# EAGLE schematic lacoolBoard_V1.1.3 (EAGLE 7.7.0)
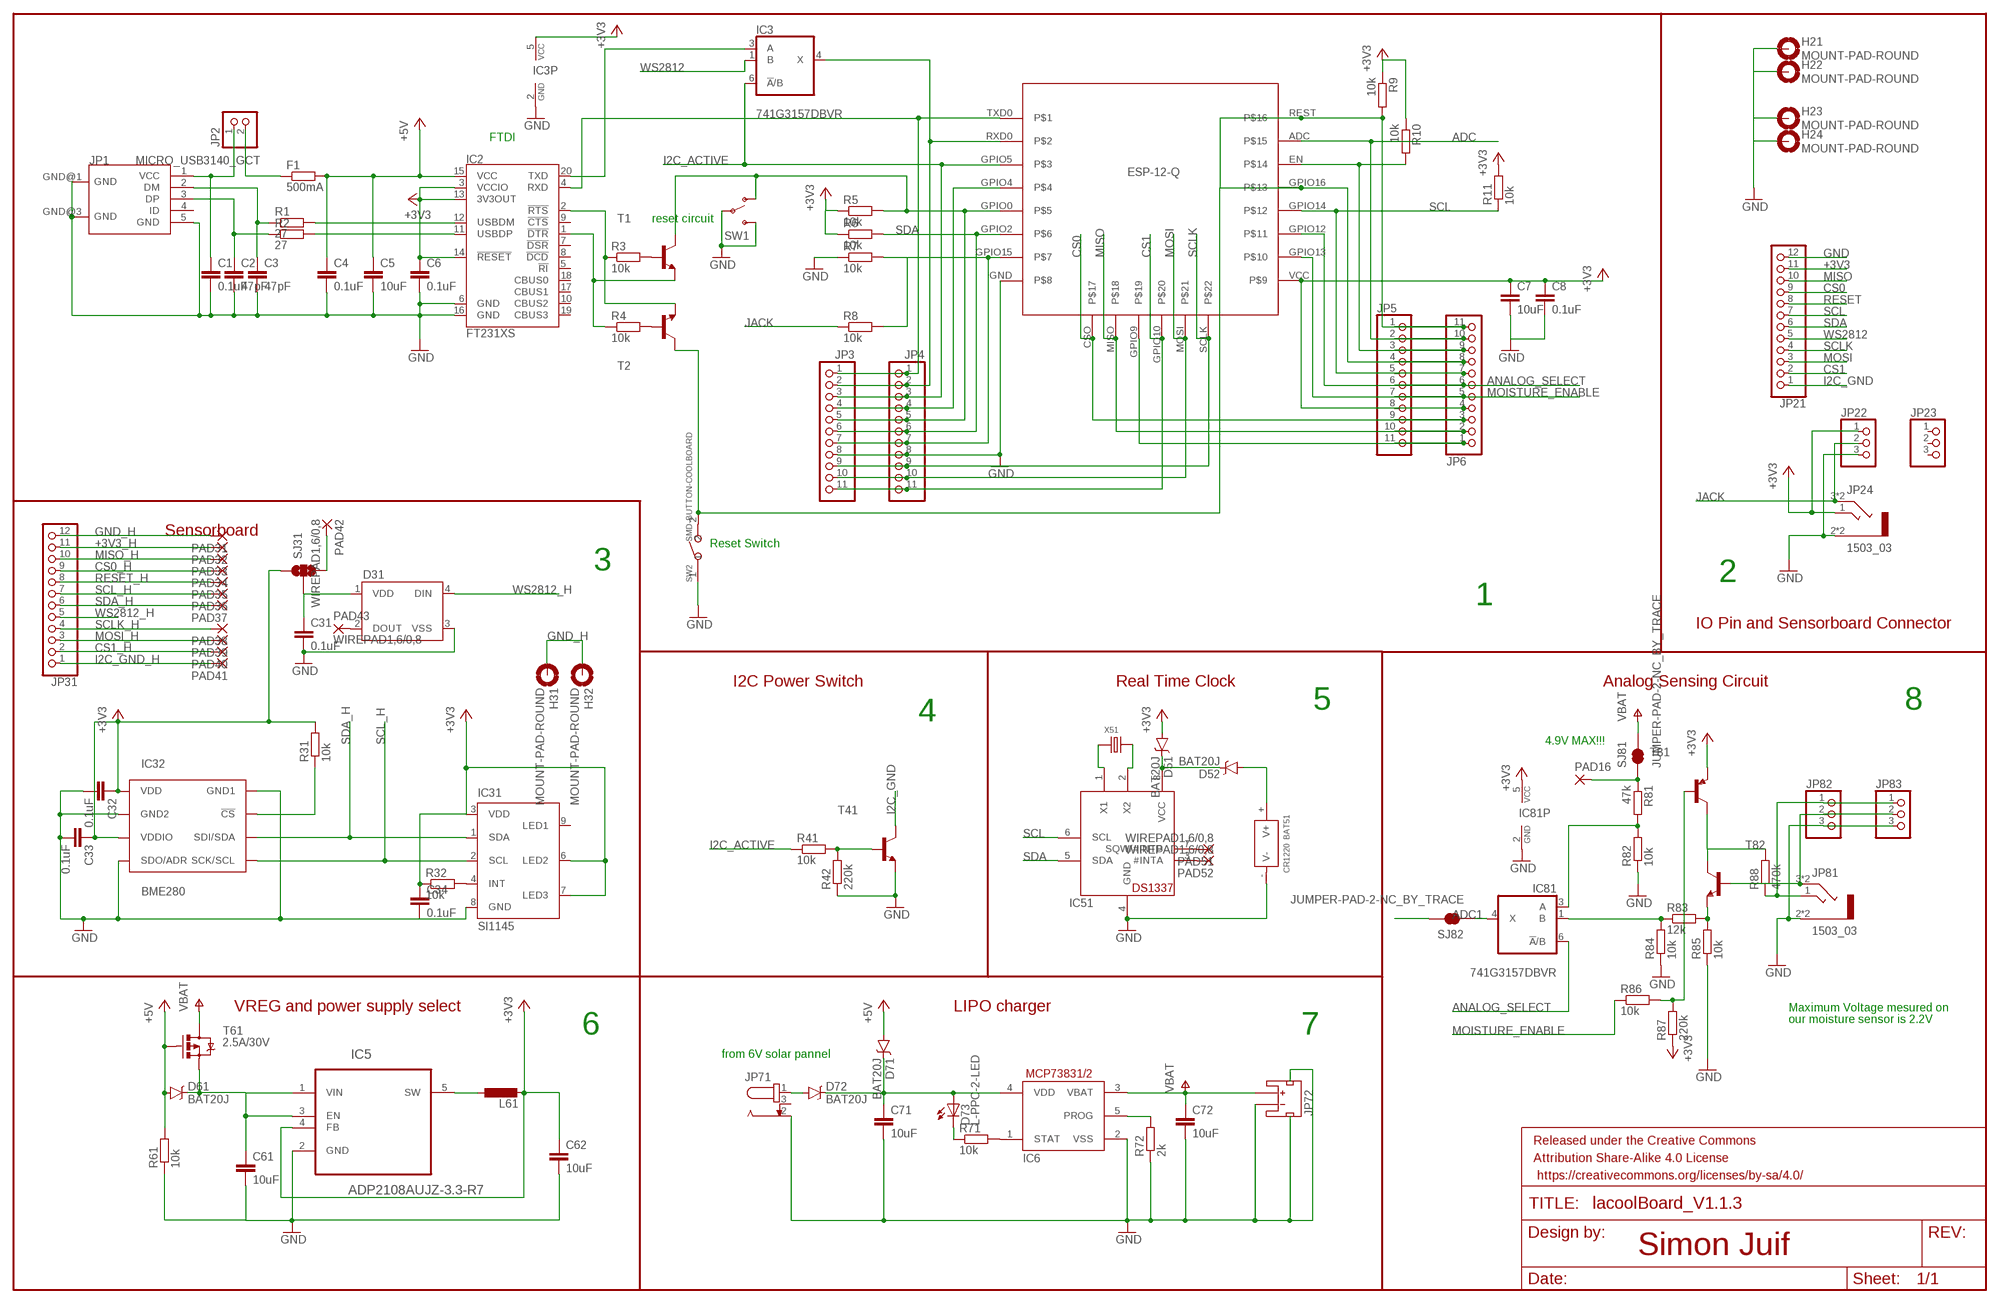
[diagram p0: schematic, sheet 1]

## Parts
BAT51  CR1220  SMD-BATTERY-CELL-HOLDER-PLASTIC  [BAT2P-SMD-16.4-CR1220]
C1  0.1uF  C-EUC0603K  [C0603K]
C2  47pF  C-EUC0603K  [C0603K]
C3  47pF  C-EUC0603K  [C0603K]
C4  0.1uF  C-EUC0603K  [C0603K]
C5  10uF  C-EUC0603K  [C0603K]
C6  0.1uF  C-EUC0603K  [C0603K]
C7  10uF  C-EUC0603K  [C0603K]
C8  0.1uF  C-EUC0603K  [C0603K]
C31  0.1uF  C-EUC0603K  [C0603K]
C32  0.1uF  C-EUC0603K  [C0603K]
C33  0.1uF  C-EUC0603K  [C0603K]
C34  0.1uF  C-EUC0603K  [C0603K]
C61  10uF  C-EUC0603K  [C0603K]
C62  10uF  C-EUC0603K  [C0603K]
C71  10uF  C-EUC0603K  [C0603K]
C72  10uF  C-EUC0603K  [C0603K]
D31  WS2812B  [WS2812B]
D51  BAT20J  DIODE-SCHOTTKY-BAT20J  [SOD-323]
D52  BAT20J  DIODE-SCHOTTKY-BAT20J  [SOD-323]
D61  BAT20J  DIODE-SCHOTTKY-BAT20J  [SOD-323]
D71  BAT20J  DIODE-SCHOTTKY-BAT20J  [SOD-323]
D72  BAT20J  DIODE-SCHOTTKY-BAT20J  [SOD-323]
D73  L-PPC-2-LED  [P-LCC-2]
F1  500mA  R-EU_M0805  [M0805]
FRAME1  FRAME-LEDGER  [CREATIVE_COMMONS]
H21  MOUNT-PAD-ROUND  [2,4-PAD]
H22  MOUNT-PAD-ROUND  [2,4-PAD]
H23  MOUNT-PAD-ROUND  [2,4-PAD]
H24  MOUNT-PAD-ROUND  [2,4-PAD]
H31  MOUNT-PAD-ROUND  [2,4-PAD]
H32  MOUNT-PAD-ROUND  [2,4-PAD]
IC1  ESP12_ENGRAVE  [ESP12Q-ENGRAVE]
IC2  FT231XS  [SSOP20_L]
IC3  741G3157DBVR  [DBV_R-PDSO-G6]
IC5  ADP2108AUJZ-3.3-R7  [SOT95P280X100-5N]
IC6  MCP73831/OT  [SOT23-5L]
IC31  SI1145  [QFN-10]
IC32  BME280  [BME280_LGA]
IC51  DS1337  [SOIC8]
IC81  741G3157DBVR  [DBV_R-PDSO-G6]
JP1  MICRO_USB3140_GCT  [USB3140-30-0230-1-C]
JP2  PINHD-1X2SMALLHOLE  [1X02SMALLHOLE]
JP3  PINHD-1X11/90  [1X11/90]
JP4  PINHD-1X11  [1X11]
JP5  PINHD-1X11  [1X11]
JP6  PINHD-1X11/90  [1X11/90]
JP21  PINHD-1X12  [1X12]
JP22  PINHD-1X3  [1X03]
JP23  PINHD-1X3  [1X03]
JP24  1503_03  [1503_03]
JP31  PINHD-1X12  [1X12]
JP71  694108402002  [694108402002]
JP72  JST_2MM_MALE  [JST-2-SMD]
JP81  1503_03  [1503_03]
JP82  PINHD-1X3  [1X03]
JP83  PINHD-1X3  [1X03]
L61  L-EUVLS3015  [VLS3015]
PAD16  SMD2  [SMD1,27-2,54]
PAD31  SMD2  [SMD1,27-2,54]
PAD32  SMD2  [SMD1,27-2,54]
PAD33  SMD2  [SMD1,27-2,54]
PAD34  SMD2  [SMD1,27-2,54]
PAD35  SMD2  [SMD1,27-2,54]
PAD36  SMD2  [SMD1,27-2,54]
PAD37  SMD2  [SMD1,27-2,54]
PAD38  SMD2  [SMD1,27-2,54]
PAD39  SMD2  [SMD1,27-2,54]
PAD40  SMD2  [SMD1,27-2,54]
PAD41  SMD2  [SMD1,27-2,54]
PAD42  WIREPAD1,6/0,8  [1,6/0,8]
PAD43  WIREPAD1,6/0,8  [1,6/0,8]
PAD51  WIREPAD1,6/0,8  [1,6/0,8]
PAD52  WIREPAD1,6/0,8  [1,6/0,8]
R1  27  R-EU_R0603  [R0603]
R2  27  R-EU_R0603  [R0603]
R3  10k  R-EU_R0603  [R0603]
R4  10k  R-EU_R0603  [R0603]
R5  10k  R-EU_R0603  [R0603]
R6  10k  R-EU_R0603  [R0603]
R7  10k  R-EU_R0603  [R0603]
R8  10k  R-EU_R0603  [R0603]
R9  10k  R-EU_R0603  [R0603]
R10  10k  R-EU_R0603  [R0603]
R11  10k  R-EU_R0603  [R0603]
R31  10k  R-EU_R0603  [R0603]
R32  10k  R-EU_R0603  [R0603]
R41  10k  R-EU_R0603  [R0603]
R42  220k  R-EU_R0603  [R0603]
R61  10k  R-EU_R0603  [R0603]
R71  10k  R-EU_R0603  [R0603]
R72  2k  R-EU_R0603  [R0603]
R81  47k  R-EU_R0603  [R0603]
R82  10k  R-EU_R0603  [R0603]
R83  12k  R-EU_R0603  [R0603]
R84  10k  R-EU_R0603  [R0603]
R85  10k  R-EU_R0603  [R0603]
R86  10k  R-EU_R0603  [R0603]
R87  220k  R-EU_R0603  [R0603]
R88  470k  R-EU_R0603  [R0603]
SJ31  SOLDERJUMPER_2WAYPASTE1&2  [SJ_3_PASTE1&2]
SJ81  JUMPER-PAD-2-NC_BY_TRACE  [PAD-JUMPER-2-NC_BY_TRACE_YES_SILK]
SJ82  JUMPER-PAD-2-NC_BY_TRACE  [PAD-JUMPER-2-NC_BY_TRACE_YES_SILK]
SW1  SWITCH-SPDT-SMD-A  [SWITCH-SPST-SMD-A]
SW2  SMD-BUTTON-COOLBOARD  [1437566-3_COOLBOARD]
T1  MMBT2222ALT1-NPN-SOT23-BEC  [SOT23-BEC]
T2  MMBT2222ALT1-NPN-SOT23-BEC  [SOT23-BEC]
T41  MMBT3904LT1-NPN-SOT23-BEC  [SOT23-BEC]
T61  2.5A/30V  MOSFET-PCHANNELDMG2307L  [SOT23-3]
T81  MMBT3906LT1-PNP-SOT23-BEC  [SOT23-BEC]
T82  MMBT3904LT1-NPN-SOT23-BEC  [SOT23-BEC]
X51  CRYSTAL'NX2012SA'  [X2-SMD-L2.0X1.2X0.55MM]

## Nets
+3V3: C6.1 C7.1 C8.1 C62.1 D51.A IC1.VCC IC2.3(VCCIO) IC2.13(3V3OUT) IC2.14(!RESET) IC3.5(VCC) IC5.4(FB) IC81.5(VCC) JP5.8 JP6.4 JP21.11 JP22.1 JP24.1 L61.P$2 R5.1 R6.1 R9.1 R10.1 R11.2 R87.1 T81.E
+3V3_H: C32.1 C33.1 C34.1 IC31.3(VDD) IC31.6(LED2) IC31.7(LED3) IC32.P$6(VDDIO) IC32.P$8(VDD) JP31.11 PAD32.1(P) R31.2 R32.1 SJ31.1 ; supply symbol labelled +3V3
+5V: C4.1 C5.1 D61.A D71.A F1.2 IC2.15(VCC) R61.2 T61.1(G)
ADC: IC1.ADC JP5.2 JP6.10 SJ82.2
ADC1: IC81.4(X) SJ82.1
ANALOG_SELECT: IC1.GPIO12 IC81.6(!A!/B) JP5.6 JP6.6
CS0: IC1.CSO JP5.9 JP6.3 JP21.9
CS0_H: JP31.9 PAD34.1(P)
CS1: IC1.GPIO10 JP3.11 JP4.11 JP21.2
CS1_H: JP31.2 PAD40.1(P)
D31: C31.2 D31.3(VSS) ; supply symbol labelled GND
GND: BAT51.-(V-) C1.2 C2.2 C3.2 C4.2 C5.2 C6.2 C7.2 C8.2 C61.2 C62.2 C71.2 C72.2 H21.B2,4(MOUNT) H22.B2,4(MOUNT) H23.B2,4(MOUNT) H24.B2,4(MOUNT) IC1.GND IC2.6(GND) IC2.16(GND) IC3.2(GND) IC5.2(GND) IC6.2(VSS) IC51.4(GND) IC81.2(GND) JP1.5(GND) JP1.GND@1(GND) JP1.GND@3(GND) JP3.8 JP4.8 JP21.12 JP22.3 JP24.2 JP24.2@1 JP71.2 JP72.1(-) JP72.NC1(PAD1) JP72.NC2(PAD2) JP81.2 JP81.2@1 JP82.3 JP83.3 R7.1 R42.1 R61.1 R72.1 R82.1 R84.1 R85.1 SW1.2(P) SW1.3(S) SW2.1 T41.E
GND_H: H31.B2,4(MOUNT) H32.B2,4(MOUNT) JP31.12 PAD31.1(P)
GPIO4: IC1.GPIO4 JP3.4 JP4.4
I2C_ACTIVE: IC1.GPIO5 IC3.6(!A!/B) JP3.3 JP4.3 R41.1
I2C_GND: JP21.1 T41.C
I2C_GND_H: C32.2 C33.2 C34.2 IC31.8(GND) IC32.P$1(GND1) IC32.P$5(SDO/ADR) IC32.P$7(GND2) JP31.1 PAD41.1(P) ; supply symbol labelled GND
JACK: JP22.2 JP24.3 JP24.3@1 R8.1
MISO: IC1.MISO JP5.10 JP6.2 JP21.10
MISO_H: JP31.10 PAD33.1(P)
MOISTURE_ENABLE: IC1.GPIO13 JP5.7 JP6.5 R86.1
MOSI: IC1.MOSI JP3.10 JP4.10 JP21.3
MOSI_H: JP31.3 PAD39.1(P)
N$3: C71.1 D71.C D72.C D73.A IC6.4(VDD)
N$4: IC6.5(PROG) R72.2
N$5: C1.1 JP1.1(VCC) JP2.1
N$6: R83.2 R85.2 T82.E
N$8: IC31.4(INT) R32.2
N$9: F1.1 JP2.2
N$10: IC6.1(STAT) R71.2
N$11: R88.2 T81.C T82.C
N$12: IC81.1(B) R83.1 R84.2
N$13: PAD16.1(P) R81.1 SJ81.1
N$14: D72.A JP71.1
N$15: IC81.3(A) R81.2 R82.2
N$16: D73.C R71.1
N$17: R86.2 R87.2 T81.B
N$18: C61.1 D61.C IC5.1(VIN) IC5.3(EN) T61.2(S)
N$19: IC5.5(SW) L61.P$1
N$20: IC1.GPIO15 JP3.7 JP4.7 R7.2 R8.2
N$22: D51.C D52.C IC51.8(VCC)
N$23: BAT51.+(V+) D52.A
N$24: C3.1 JP1.2(DM) R1.1
N$25: C2.1 JP1.3(DP) R2.1
N$26: IC2.12(USBDM) R1.2
N$27: IC2.11(USBDP) R2.2
N$28: IC1.EN JP5.3 JP6.9 R10.2
N$29: C31.1 D31.1(VDD) SJ31.2
N$30: IC32.P$2(!CS) R31.1
N$31: D31.2(DOUT) PAD43.1(P)
N$32: IC51.3(#INTA) PAD52.1(P)
N$33: IC51.7(SQW/#INTB) PAD51.1(P)
N$34: PAD42.1(P) SJ31.3
N$35: R41.2 R42.2 T41.B
N$36: IC2.1(!DTR) R4.1 T1.E
N$37: R4.2 T2.B
N$38: R3.2 T1.B
N$39: IC2.2(!RTS) R3.1 T2.E
N$40: IC2.20(TXD) IC3.3(A)
N$48: IC1.GPIO0 JP3.5 JP4.5 R5.2 SW1.1(O) T1.C
N$56: IC51.1(X1) X51.1
N$59: IC51.2(X2) X51.2
N$68: IC1.GPIO9 JP5.11 JP6.1
PROBE1: JP81.3 JP81.3@1 JP82.2 JP83.2 T82.B
PROBE2: JP81.1 JP82.1 JP83.1 R88.1
RESET: IC1.GPIO16 IC1.REST JP5.1 JP5.4 JP6.8 JP6.11 JP21.8 R9.2 SW2.2 T2.C
RESET_H: JP31.8 PAD35.1(P)
RX1: IC1.TXD0 IC2.4(RXD) JP3.1 JP4.1
SCL: IC1.GPIO14 IC51.6(SCL) JP5.5 JP6.7 JP21.7 R11.1
SCL_H: IC31.2(SCL) IC32.P$4(SCK/SCL) JP31.7 PAD36.1(P)
SCLK: IC1.SCLK JP3.9 JP4.9 JP21.4
SCLK_H: JP31.4 PAD38.1(P)
SDA: IC1.GPIO2 IC51.5(SDA) JP3.6 JP4.6 JP21.6 R6.2
SDA_H: IC31.1(SDA) IC32.P$3(SDI/SDA) JP31.6 PAD37.1(P)
TX1: IC1.RXD0 IC3.4(X) JP3.2 JP4.2
V+: C72.1 IC6.3(VBAT) JP72.2(+) SJ81.2 T61.3(D) ; supply symbol labelled VBAT
WS2812: IC3.1(B) JP21.5
WS2812_H: D31.4(DIN) JP31.5
Unconnected: IC2.5(!RI) IC2.7(!DSR) IC2.8(!DCD) IC2.9(!CTS) IC2.10(CBUS2) IC2.17(CBUS1) IC2.18(CBUS0) IC2.19(CBUS3) IC31.9(LED1) JP1.4(ID) JP23.1 JP23.2 JP23.3 JP71.3

## Notes on the sheet
- FTDI
- reset circuit
- Sensorboard
- Reset Switch
- 3
- 2
- 1
- IO Pin and Sensorboard Connector
- I2C Power Switch | Real Time Clock | Analog Sensing Circuit
- 5 | 8
- 4
- 4.9V MAX!!!
- VREG and power supply select | LIPO charger | Maximum Voltage mesured on
- our moisture sensor is 2.2V
- 6 | 7
- from 6V solar pannel
- Simon Juif

## Library data of the parts
BAT51 = Seeed-OPL-Connector:SMD-BATTERY-CELL-HOLDER-PLASTIC: 320170000
C1-C8 C31-C34 C61 C62 C71 C72 = rcl:C-EU: CAPACITOR, European symbol
D31 = SparkFun-LED:WS2812B: WS2812B - Intelligent control LED integrated light source Technical Specifications: Power Supply Voltage (VDD): 3.5 to 5.3 V Input Voltage (VI): -0.5 to VDD+0.5 V Operating Junction Temperature (Topt): -25°C to +80°C Storage Temperature Range (Tstg): -55°C to +150°C; PROD_ID: DIO-12503
D51 D52 D61 D71 D72 = SparkFun-DiscreteSemi:DIODE-SCHOTTKY: Schottky diodes in SFE's production catalog BAT20J 1A 23V 0.62Vf RB751 120mA 40V 0.37Vf PMEG4005EJ 0.5A 40V 0.42Vf MBRA140 1A 40V 0.5Vf B340A 3A 40V SMA; PROD_ID: DIO-11623
D73 = custom parts:L-PPC-2-LED
F1 R1-R11 R31 R32 R41 R42 R61 R71 R72 R81-R88 = rcl:R-EU_: RESISTOR, European symbol
FRAME1 = SparkFun-Aesthetics:FRAME-LEDGER: Schematic Frame Standard 11x14 US Ledger frame
H21-H24 H31 H32 = holes:MOUNT-PAD-ROUND: MOUNTING PAD, round
IC1 = ESP12Q:ESP12_ENGRAVE
IC2 = SparkFun-DigitalIC:FT231X: FTDI FT231X Full Speed USB to Full-handshake UART This USB2.0 Full Speed IC offers a compact bridge to full handshake UART interfaces. The device is a UART, capable of operating up to 3MBaud, with low power consumption (8mA). The FT231X includes the complete FT-X series feature set and enables USB to be added into a system design quickly and easily over a UART interface.; PROD_ID: IC-11524
IC3 IC81 = 74xx-little-de:74*1G3157: Single-Pole, Double-Throw Analog Switch Source: http://focus.ti.com/lit/ds/symlink/sn74lvc1g3157.pdf
IC5 = ADP2108AUJZ:ADP2108AUJZ-3.3-R7: Compact, 600 mA, 3 MHz, Step-Down DC-to-DC Converter; MPN: ADP2108AUJZ-3.3-R7; OC_FARNELL: 2112606; OC_NEWARK: 25R1927; PACKAGE: TSOT-23-5; SUPPLIER: Analog Devices
IC6 = adafruit:MCP73831: MCP73831/2 Miniature Single-Cell, Fully Integrated Li-Ion, Li-Polymer Charge Management Controllers. Nice and small simple lipoly charge controller, with adjustable current and status output (LED) http://www.ladyada.net/library/pcb/eaglelibrary.html
IC31 = silabs:SI114*: PROXIMITY/UV/AMBIENT LIGHT SENSOR IC WITH I2C INTERFACE Source: http://www.silabs.com/Support%20Documents/TechnicalDocs/Si1145-46-47.pdf
IC32 = BME280ComponentLibrary:BME280; PROD_ID: IC-13090
IC51 = custom parts:DS1337
JP1 = custom parts:MICRO_USB3140_GCT
JP2 = pinhead:PINHD-1X2SMALLHOLE: PIN HEADER
JP3-JP6 = pinhead:PINHD-1X11: PIN HEADER
JP21 JP31 = pinhead:PINHD-1X12: PIN HEADER
JP22 JP23 JP82 JP83 = pinhead:PINHD-1X3: PIN HEADER
JP24 JP81 = con-lumberg:1503_03
JP71 = EAGLE-WR-DC_POWER_JACK_CONNECTORS-rev16a:694108402002: WR-DC_DC Power Jack_Vertical_THT Center Pin Ø2.5_Plug ID Ø2.55_Plug OD Ø5.5 ;=>Code : Con_WR-DC_THT_6941xx402002_694108402002 <http://katalog.we-online.de/media/images/eican/Con_WR-DC_THT_6941xx402002_pf2.jpg> Details see: http://katalog.we-online.de/em/datasheet/6941xx402002.pdf Created 2014-10-08, Karrer Zheng 2014 (C) Wurth Elektronik
JP72 = SparkFun-Connectors:JST_2MM_MALE: Mates to single-cell LiPo batteries. CONN-11443 Now with smashable polarity marks!; BTM_NEG: -; BTM_POS: +; PROD_ID: CONN-11443; TOP_NEG: -; TOP_POS: +
L61 = rcl:L-EU: INDUCTOR, European symbol
PAD16 PAD31-PAD41 = wirepad:SMD2: SMD PAD
PAD42 PAD43 PAD51 PAD52 = wirepad:WIREPAD: Wire PAD connect wire on PCB
SJ31 = SparkFun-Retired:SOLDERJUMPER_2WAY: Solder Jumper 2 way solder jumper
SJ81 SJ82 = SparkFun-Passives:JUMPER-PAD-2-NC_BY_TRACE
SW1 = SparkFun-Electromechanical:SWITCH-SPDT: SPDT Switch Simple slide switch, Spark Fun Electronics SKU : COM-00102 DPDT SMT slide switch, AYZ0202, SWCH-08179; PROD_ID: SWCH-10651
SW2 = Seeed-OPL-Switch:SMD-BUTTON-COOLBOARD
T1 T2 T41 T82 = transistor:*-NPN-: NPN Transistror BF959 corrected 2008.03.06
T61 = SparkFun-DiscreteSemi:MOSFET-PCHANNEL: Generic PMOSFET IRLML2244 - TRANS-11153 (SOT-23 -20V -4.3A) (1.Gate 2.Source 3.Drain) FQP27P06 - COM-10349 <http://www.sparkfun.com/products/10349> (TO-220 -60V -27A) (1.Gate 2.Source 3.Drain); PROD_ID: TRANS-11308
T81 = transistor:*-PNP-: PNP Transistror
X51 = Seeed-OPL-crystal-osctllator:CRYSTAL